# EAGLE design motor_bench_lpc (EAGLE 4.16)
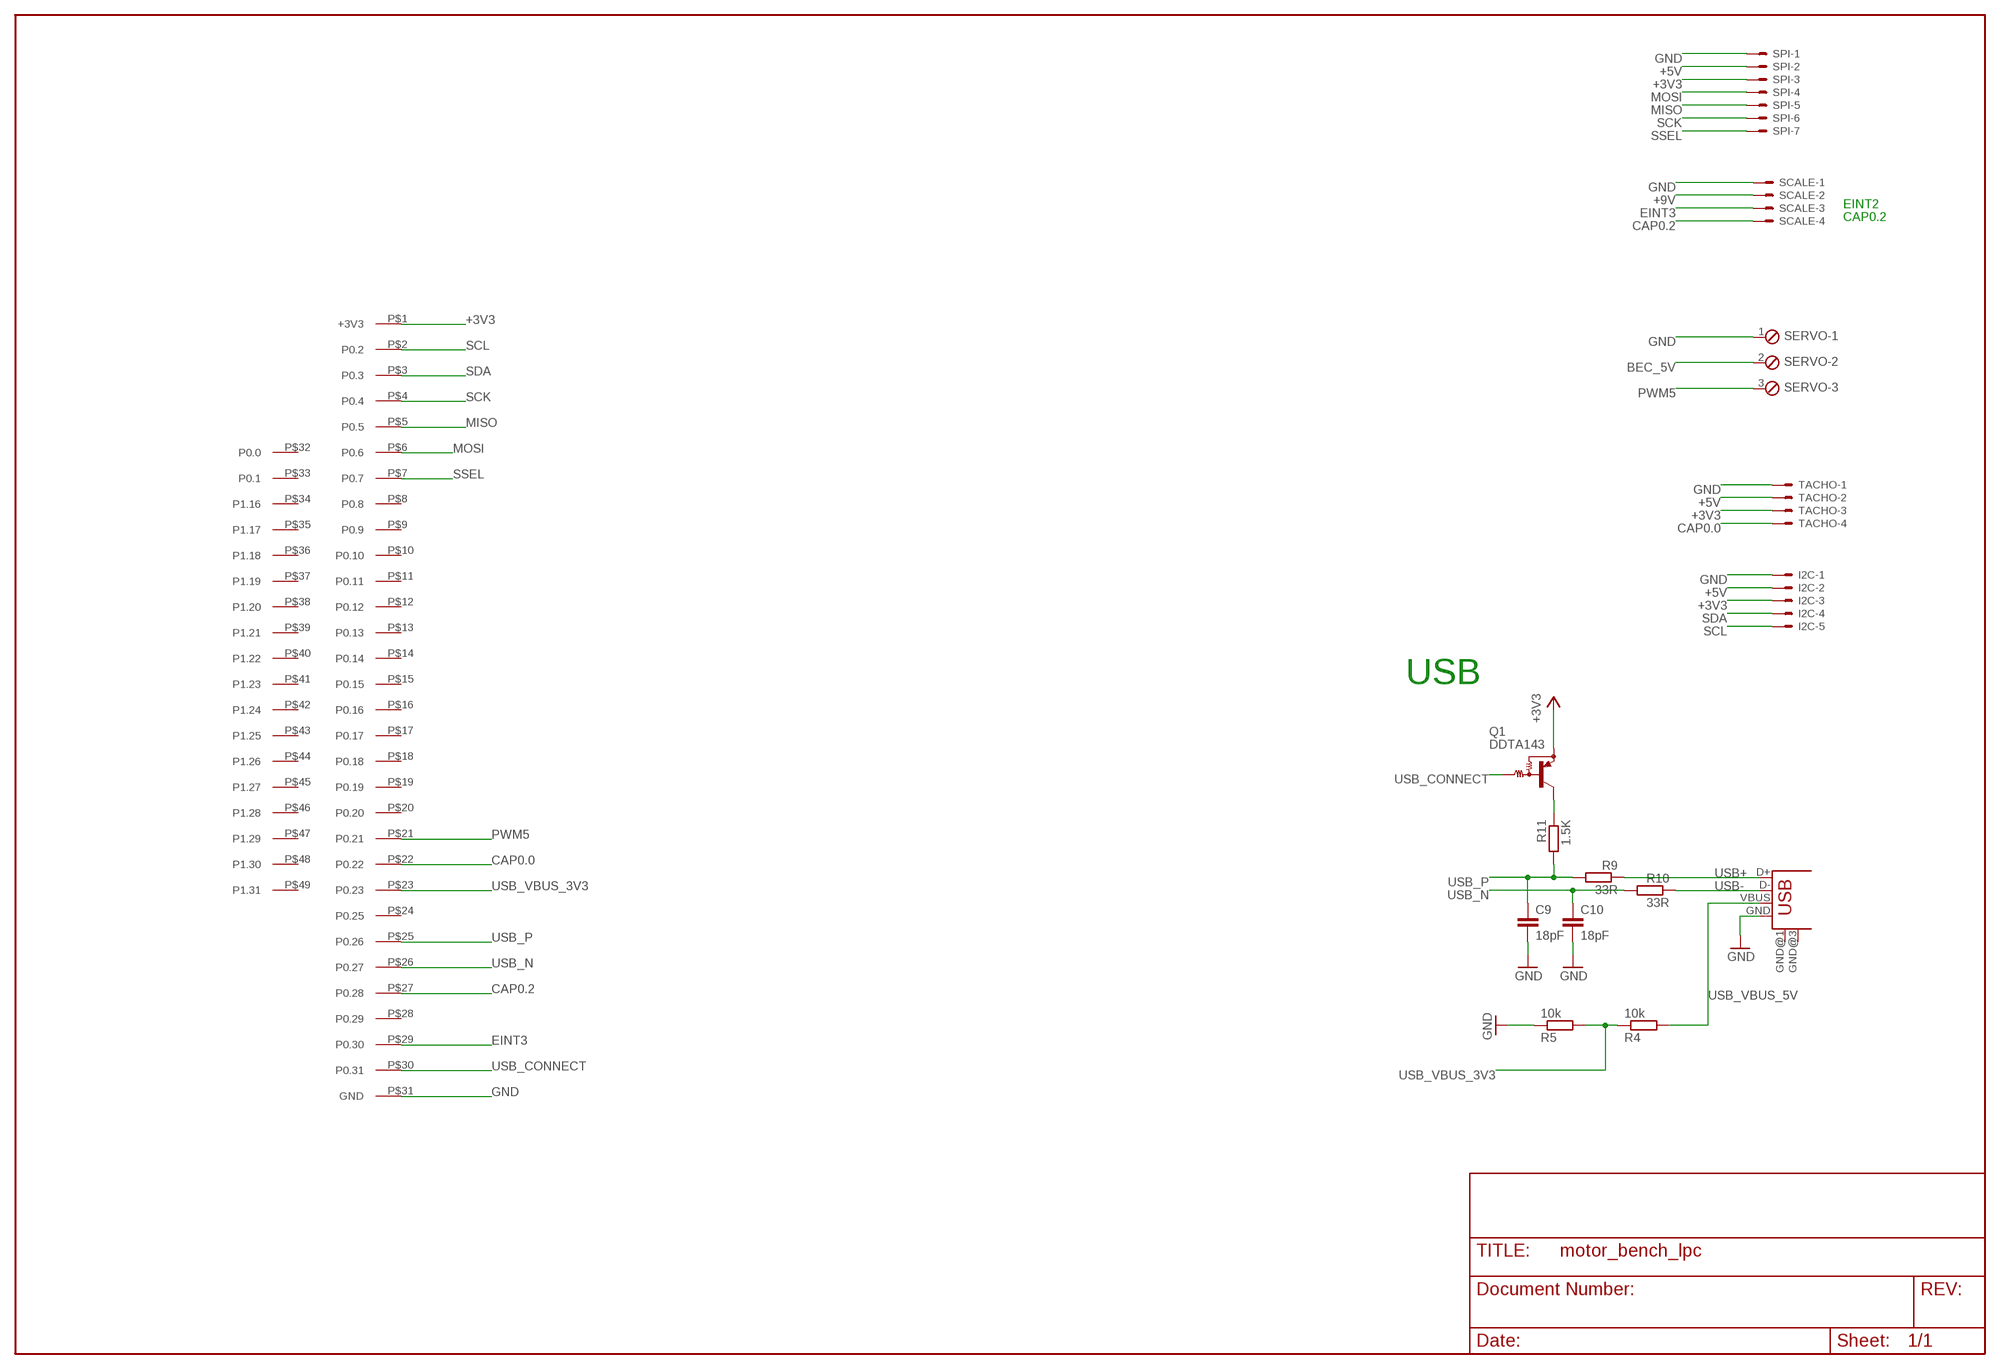
[diagram p0: schematic, sheet 1]

## Parts
C9  18pF  C-EUC0402K  [C0402K]
C10  18pF  C-EUC0402K  [C0402K]
I2C  53047-05  [53047-05]
Q1  DDTA143  MUN2111T1  [SC59-BEC]
R4  10k  R-EU_R1005  [R1005]
R5  10k  R-EU_R1005  [R1005]
R9  33R  R-EU_R1005  [R1005]
R10  33R  R-EU_R1005  [R1005]
R11  1.5K  R-EU_R1005  [R1005]
SCALE  53047-04  [53047-04]
SERVO  MPT3  [3POL254]
SPI  53047-07  [53047-07]
TACHO  53047-04  [53047-04]
U$2  OLIMEX_DEV  [OLIMEX_DEV]
USB1  USB-MB-S  [USB-MB-S]

## Nets
+3V3: I2C.3 Q1.E SPI.3 TACHO.3 U$2.P$1(+3V3)
+5V: I2C.2 SPI.2 TACHO.2
+9V: SCALE.2
BEC_5V: SERVO.2
CAP0.0: TACHO.4 U$2.P$22(P0.22)
CAP0.2: SCALE.4 U$2.P$27(P0.28)
EINT3: SCALE.3 U$2.P$29(P0.30)
GND: C9.2 C10.2 I2C.1 R5.1 SCALE.1 SERVO.1 SPI.1 TACHO.1 U$2.P$31(GND) USB1.GND
MISO: SPI.5 U$2.P$5(P0.5)
MOSI: SPI.4 U$2.P$6(P0.6)
N$14: Q1.C R11.1
PWM5: SERVO.3 U$2.P$21(P0.21)
SCK: SPI.6 U$2.P$4(P0.4)
SCL: I2C.5 U$2.P$2(P0.2)
SDA: I2C.4 U$2.P$3(P0.3)
SSEL: SPI.7 U$2.P$7(P0.7)
USB+: R9.1 USB1.D+
USB-: R10.1 USB1.D-
USB_CONNECT: Q1.B U$2.P$30(P0.31)
USB_N: C10.1 R10.2 U$2.P$26(P0.27)
USB_P: C9.1 R9.2 R11.2 U$2.P$25(P0.26)
USB_VBUS_3V3: R4.1 R5.2 U$2.P$23(P0.23)
USB_VBUS_5V: R4.2 USB1.VBUS
Unconnected: U$2.P$8(P0.8) U$2.P$9(P0.9) U$2.P$10(P0.10) U$2.P$11(P0.11) U$2.P$12(P0.12) U$2.P$13(P0.13) U$2.P$14(P0.14) U$2.P$15(P0.15) U$2.P$16(P0.16) U$2.P$17(P0.17) U$2.P$18(P0.18) U$2.P$19(P0.19) U$2.P$20(P0.20) U$2.P$24(P0.25) U$2.P$28(P0.29) U$2.P$32(P0.0) U$2.P$33(P0.1) U$2.P$34(P1.16) U$2.P$35(P1.17) U$2.P$36(P1.18) U$2.P$37(P1.19) U$2.P$38(P1.20) U$2.P$39(P1.21) U$2.P$40(P1.22) U$2.P$41(P1.23) U$2.P$42(P1.24) U$2.P$43(P1.25) U$2.P$44(P1.26) U$2.P$45(P1.27) U$2.P$46(P1.28) U$2.P$47(P1.29) U$2.P$48(P1.30) U$2.P$49(P1.31) USB1.GND@1(GND) USB1.GND@3(GND)

## Notes on the sheet
- EINT2
- CAP0.2
- USB

## Library data of the parts
C9 C10 = rcl:C-EU: CAPACITOR, European symbol
I2C = con-molex:53?-05: CONNECTOR wire to board 1.25 mm (.049 inch) pitch header
Q1 = transistor-pnp:MUN2111*: PNP Bias Resistor Transistor
R4 R5 R9-R11 = rcl:R-EU_: RESISTOR, European symbol
SCALE TACHO = con-molex:53?-04: CONNECTOR wire to board 1.25 mm (.049 inch) pitch header
SERVO = con-phoenix-254:MPT3: PHOENIX CONNECTOR
SPI = con-molex:53?-07: CONNECTOR wire to board 1.25 mm (.049 inch) pitch header
U$2 = paparazzi:OLIMEX_DEV
USB1 = con-usb-2:USB: USB Connectors

## Board
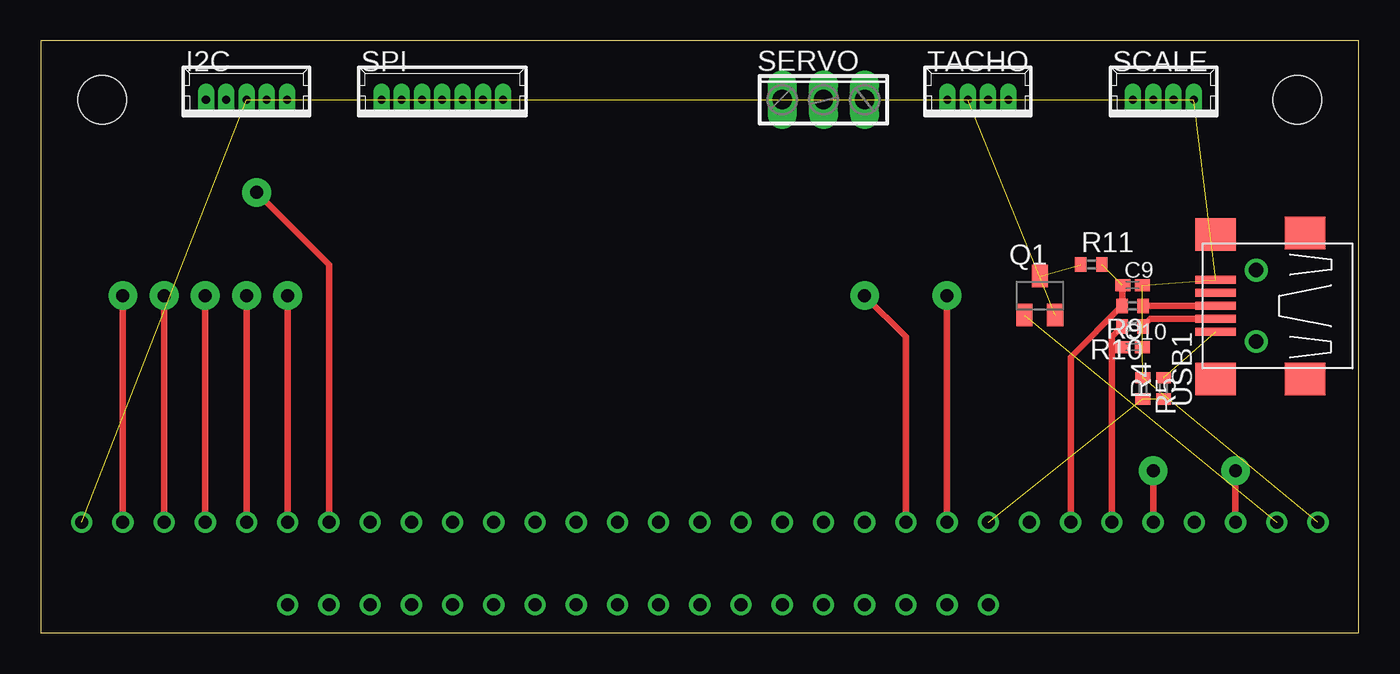
[diagram p1: board, top side]
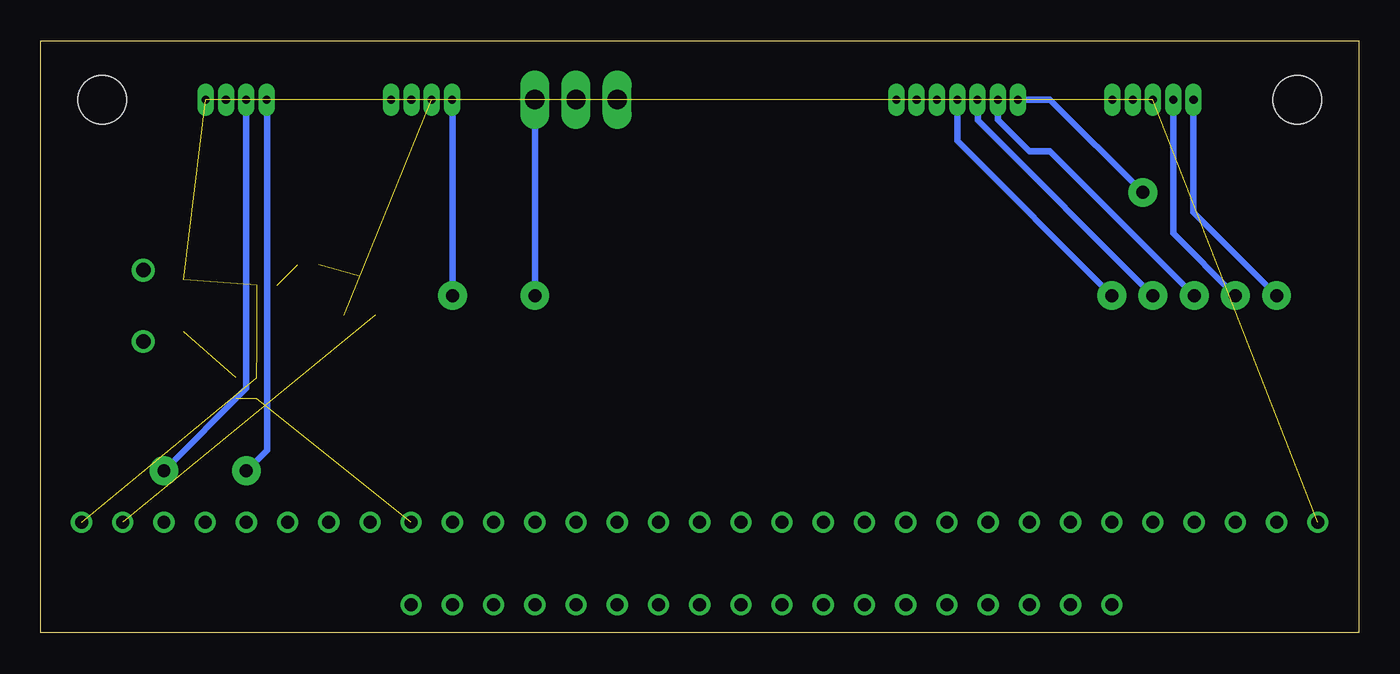
[diagram p2: board, bottom side, seen from below]

Size 81.26 x 36.5 mm. Coordinates in mm from the lower left corner, seen from the top.
Outline: 0,0 81.26,0 81.26,36.5 0,36.5 0,0
Copper layers (1*16): Top 0.035mm / dielectric 1.5mm / Bottom 0.035mm
Design rules "default": minimum track width 10mil, minimum drill 24mil, track to track 8mil, track to pad 8mil, pad to pad 8mil, via to via 8mil, smd to smd 8mil, copper to edge 40mil, drill to drill 8mil, minimum pad ring 10mil, minimum via ring 8mil, stop-mask expansion 4mil, vias tented up to drill 0mil, thermal gap 10mil
Holes 3 mm at 3.8,32.85 77.47,32.85

### Footprints (pad centres in the part's own frame; a part is rotated, then mirrored left to right if it is on the bottom)
C0402K = smd 0.925 x 0.74: 1 -0.6,0; 2 0.6,0
53047-05 = drill 0.5 pad 0.698 long: 1 2.5,0; 2 1.25,0; 3 0,0; 4 -1.25,0; 5 -2.5,0
SC59-BEC = smd 1 x 1.4: B -0.95,-1.2; C 0,1.2; E 0.95,-1.2
R1005 = smd 0.7 x 0.9: 1 -0.65,0; 2 0.65,0
53047-04 = drill 0.5 pad 0.698 long: 1 1.875,0; 2 0.625,0; 3 -0.625,0; 4 -1.875,0
3POL254 = drill 1.2 long: 1 -2.54,0; 2 0,0; 3 2.54,0
53047-07 = drill 0.5 pad 0.698 long: 1 3.75,0; 2 2.5,0; 3 1.25,0; 4 0,0; 5 -1.25,0; 6 -2.5,0; 7 -3.75,0
OLIMEX_DEV = drill 0.8 round: P$1 0,0; P$2 2.54,0; P$3 5.08,0; P$4 7.62,0; P$5 10.16,0; P$6 12.7,0; P$7 15.24,0; P$8 17.78,0; P$9 20.32,0; P$10 22.86,0; P$11 25.4,0; P$12 27.94,0; P$13 30.48,0; P$14 33.02,0; P$15 35.56,0; P$16 38.1,0; P$17 40.64,0; P$18 43.18,0; P$19 45.72,0; P$20 48.26,0; P$21 50.8,0; P$22 53.34,0; P$23 55.88,0; P$24 58.42,0; P$25 60.96,0; P$26 63.5,0; P$27 66.04,0; P$28 68.58,0; P$29 71.12,0; P$30 73.66,0; P$31 76.2,0; P$32 12.7,-5.08; P$33 15.24,-5.08; P$34 17.78,-5.08; P$35 20.32,-5.08; P$36 22.86,-5.08; P$37 25.4,-5.08; P$38 27.94,-5.08; P$39 30.48,-5.08; P$40 33.02,-5.08; P$41 35.56,-5.08; P$42 38.1,-5.08; P$43 40.64,-5.08; P$44 43.18,-5.08; P$45 45.72,-5.08; P$46 48.26,-5.08; P$47 50.8,-5.08; P$48 53.34,-5.08; P$49 55.88,-5.08
USB-MB-S = smd 2.5 x 0.5: D+ 2.5,0; D- 2.5,0.8; GND 2.5,-1.6; ID 2.5,-0.8; VBUS 2.5,1.6 | smd 2.5 x 2: GND@1 -3,4.5; GND@2 2.5,4.5; GND@3 -3,-4.5; GND@4 2.5,-4.4 | drill 0.9 round: P$5 0,2.2; P$6 0,-2.2

### Placement (x,y rotation side)
C9  67.31,21.42 0 top
C10  67.31,17.61 0 top
I2C  12.7,32.85 0 top
Q1  61.59,20.79 0 top
R4  69.21,15.08 90 top
R5  67.94,15.08 270 top
R9  67.31,20.15 180 top
R10  67.31,18.88 180 top
R11  64.77,22.7 0 top
SCALE  69.21,32.85 0 top
SERVO  48.26,32.85 0 top
SPI  24.76,32.85 0 top
TACHO  57.78,32.85 0 top
U$2  2.54,6.82 0 top
USB1  74.92,20.15 180 top

### Tracks (layer width: path | path; a pad name or v marks a point on that pad's centre or on a via)
+3V3  (4 unrouted)
+5V  (2 unrouted)
CAP0.0  (via drill 0.8 pad 1.78)
  Top 0.406: U$2.P$22 v55.88,20.79
  Bottom 0.406: TACHO.4 55.88,32.82 v55.88,20.79
CAP0.2  (via drill 0.8 pad 1.78)
  Top 0.406: U$2.P$27 v68.58,10
  Bottom 0.406: SCALE.4 67.31,32.85 67.31,11.27 v68.58,10
EINT3  (via drill 0.8 pad 1.78)
  Top 0.406: U$2.P$29 v73.66,10
  Bottom 0.406: SCALE.3 68.58,15.08 v73.66,10
GND  (9 unrouted)
MISO  (via drill 0.8 pad 1.78)
  Top 0.406: U$2.P$5 v12.7,20.79
  Bottom 0.406: SPI.5 23.49,32.85 23.49,31.58 v12.7,20.79
MOSI  (via drill 0.8 pad 1.78)
  Top 0.406: U$2.P$6 v15.24,20.79
  Bottom 0.406: v15.24,20.79 24.76,30.31 SPI.4
N$14  (1 unrouted)
PWM5  (via drill 0.8 pad 1.78)
  Top 0.406: v50.8,20.79 53.34,18.25 U$2.P$21
  Bottom 0.406: v50.8,20.79 SERVO.3
SCK  (via drill 0.8 pad 1.78)
  Top 0.406: U$2.P$4 v10.16,20.79
  Bottom 0.406: v10.16,20.79 19.05,29.68 20.32,29.68 22.26,31.62 SPI.6
SCL  (via drill 0.8 pad 1.78)
  Top 0.406: U$2.P$2 v5.08,20.79
  Bottom 0.406: I2C.5 10.2,25.91 v5.08,20.79
SDA  (via drill 0.8 pad 1.78)
  Top 0.406: U$2.P$3 v7.61,20.79
  Bottom 0.406: I2C.4 11.45,24.62 v7.61,20.79
SSEL  (via drill 0.8 pad 1.78)
  Top 0.406: v13.33,27.14 17.78,22.7 U$2.P$7
  Bottom 0.406: v13.33,27.14 19.05,32.85 SPI.7
USB+
  Top 0.406: 67.94,20.15 R9.1 USB1.D+
USB-
  Top 0.406: R10.1 67.94,18.88 68.41,19.36 USB1.D-
USB_CONNECT  (1 unrouted)
USB_N
  Top 0.406: R10.2 66.03,18.27 66.03,17.61 | U$2.P$26 66.03,17.61 | 66.03,17.61 C10.1
USB_P  (1 unrouted)
  Top 0.406: U$2.P$25 63.49,16.99 R9.2 66.67,20.17 66.67,21.42 C9.1
USB_VBUS_3V3  (2 unrouted)
USB_VBUS_5V  (1 unrouted)